# EAGLE design ramanPi_powerControlBoard (EAGLE 6.2)
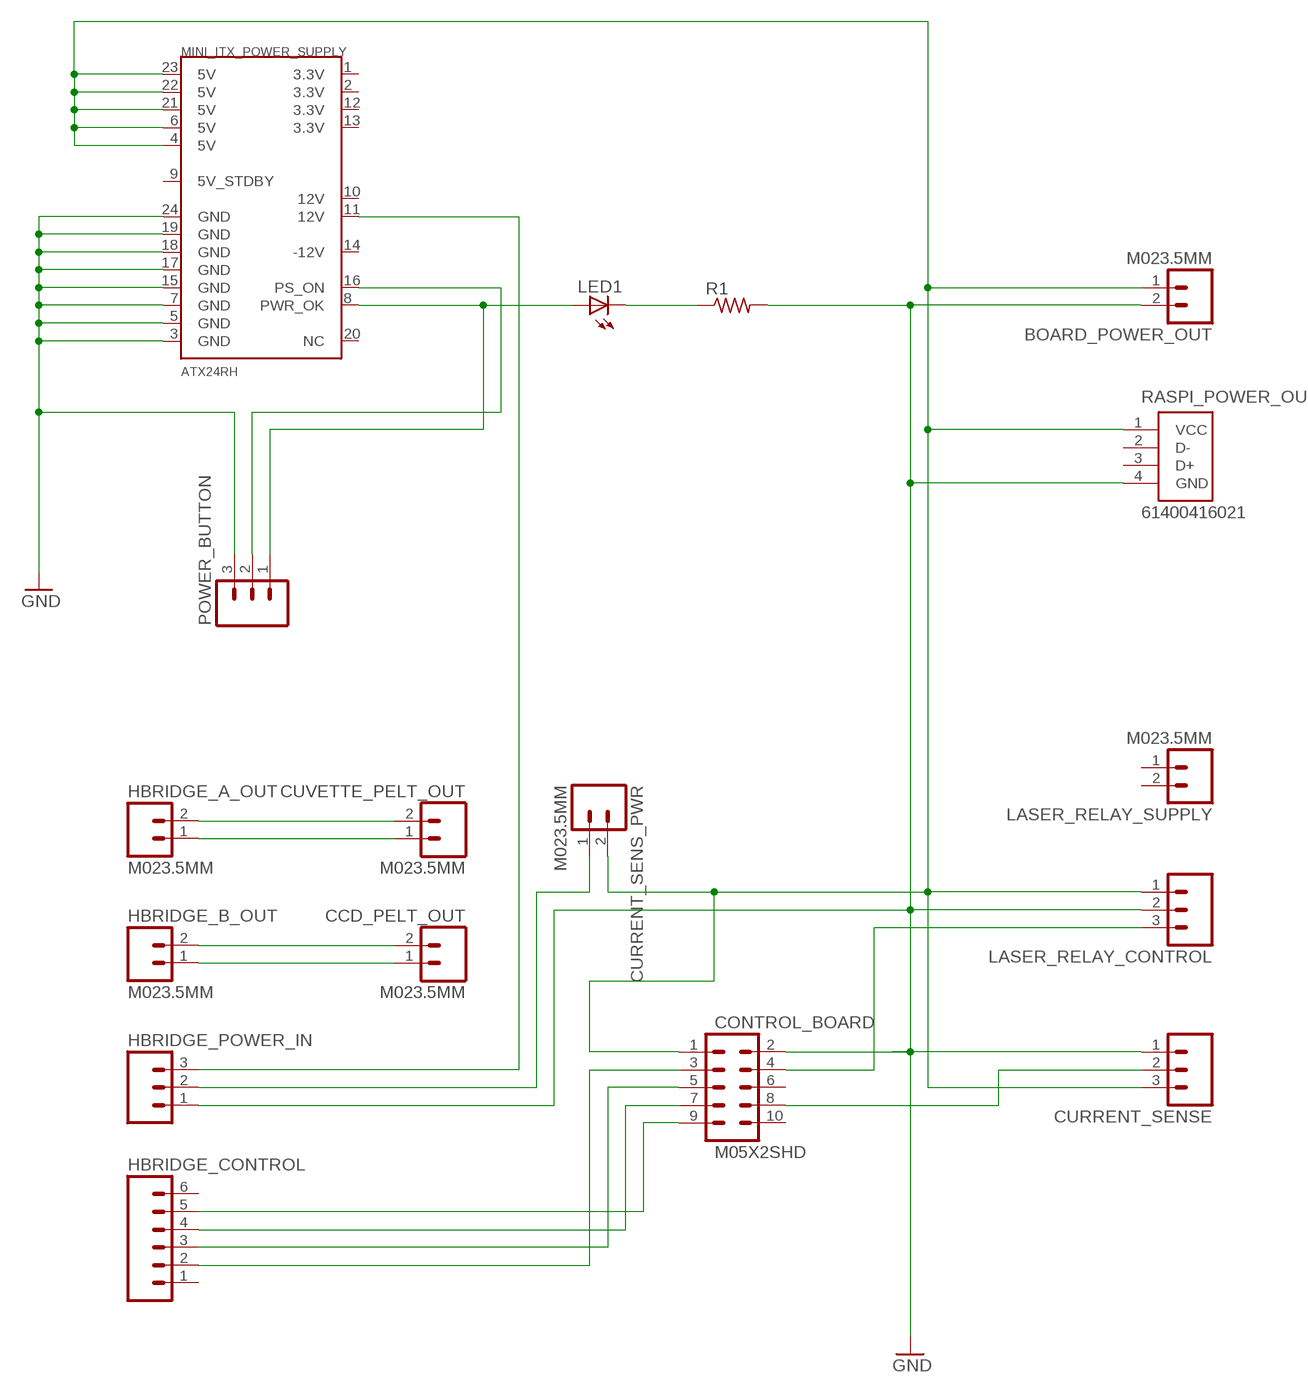
[diagram p0: schematic, sheet 1]

## Parts
BOARD_POWER_OUT  M023.5MM  [SCREWTERMINAL-3.5MM-2]
CCD_PELT_OUT  M023.5MM  [SCREWTERMINAL-3.5MM-2]
CONTROL_BOARD  M05X2SHD  [2X5-SHROUDED]
CURRENT_SENS_PWR  M023.5MM  [SCREWTERMINAL-3.5MM-2]
CURRENT_SENSE  M03PTH  [1X03]
CUVETTE_PELT_OUT  M023.5MM  [SCREWTERMINAL-3.5MM-2]
HBRIDGE_A_OUT  M023.5MM  [SCREWTERMINAL-3.5MM-2]
HBRIDGE_B_OUT  M023.5MM  [SCREWTERMINAL-3.5MM-2]
HBRIDGE_CONTROL  M06SIP  [1X06]
HBRIDGE_POWER_IN  M03SCREW  [SCREWTERMINAL-3.5MM-3]
LASER_RELAY_CONTROL  M03PTH  [1X03]
LASER_RELAY_SUPPLY  M023.5MM  [SCREWTERMINAL-3.5MM-2]
LED1  LED5MM  [LED5MM]
MINI_ITX_POWER_SUPPLY  ATX24RH  [ATX24_RIGHT_ANGLE]
POWER_BUTTON  M03JST-PTH-VERT  [JST-3-PTH-VERT]
R1  R-US_M1206  [M1206]
RASPI_POWER_OUT  61400416021  [61400416021]

## Nets
GND: BOARD_POWER_OUT.2 CONTROL_BOARD.2 CURRENT_SENSE.1 HBRIDGE_POWER_IN.1 LASER_RELAY_CONTROL.2 MINI_ITX_POWER_SUPPLY.3(GND) MINI_ITX_POWER_SUPPLY.5(GND) MINI_ITX_POWER_SUPPLY.7(GND) MINI_ITX_POWER_SUPPLY.15(GND) MINI_ITX_POWER_SUPPLY.17(GND) MINI_ITX_POWER_SUPPLY.18(GND) MINI_ITX_POWER_SUPPLY.19(GND) MINI_ITX_POWER_SUPPLY.24(GND) POWER_BUTTON.3 R1.2 RASPI_POWER_OUT.4(GND)
N$1: CONTROL_BOARD.4 LASER_RELAY_CONTROL.3
N$2: LED1.A MINI_ITX_POWER_SUPPLY.8(PWR_OK) POWER_BUTTON.1
N$3: CONTROL_BOARD.8 CURRENT_SENSE.2
N$5: MINI_ITX_POWER_SUPPLY.16(PS_ON) POWER_BUTTON.2
N$6: LED1.K(C) R1.1
N$7: CONTROL_BOARD.9 HBRIDGE_CONTROL.5
N$8: HBRIDGE_POWER_IN.3 MINI_ITX_POWER_SUPPLY.11(12V)
N$9: CUVETTE_PELT_OUT.1 HBRIDGE_A_OUT.1
N$10: CUVETTE_PELT_OUT.2 HBRIDGE_A_OUT.2
N$11: CCD_PELT_OUT.2 HBRIDGE_B_OUT.2
N$12: CCD_PELT_OUT.1 HBRIDGE_B_OUT.1
N$13: CONTROL_BOARD.7 HBRIDGE_CONTROL.4
N$14: CONTROL_BOARD.5 HBRIDGE_CONTROL.3
N$15: CONTROL_BOARD.3 HBRIDGE_CONTROL.2
N$16: CURRENT_SENS_PWR.1 HBRIDGE_POWER_IN.2
N$17: BOARD_POWER_OUT.1 CONTROL_BOARD.1 CURRENT_SENS_PWR.2 CURRENT_SENSE.3 LASER_RELAY_CONTROL.1 MINI_ITX_POWER_SUPPLY.4(5V) MINI_ITX_POWER_SUPPLY.6(5V) MINI_ITX_POWER_SUPPLY.21(5V) MINI_ITX_POWER_SUPPLY.22(5V) MINI_ITX_POWER_SUPPLY.23(5V) RASPI_POWER_OUT.1(VCC)
Unconnected: CONTROL_BOARD.6 CONTROL_BOARD.10 HBRIDGE_CONTROL.1 HBRIDGE_CONTROL.6 LASER_RELAY_SUPPLY.1 LASER_RELAY_SUPPLY.2 MINI_ITX_POWER_SUPPLY.1(3.3V) MINI_ITX_POWER_SUPPLY.2(3.3V) MINI_ITX_POWER_SUPPLY.9(5V_STDBY) MINI_ITX_POWER_SUPPLY.10(12V) MINI_ITX_POWER_SUPPLY.12(3.3V) MINI_ITX_POWER_SUPPLY.13(3.3V) MINI_ITX_POWER_SUPPLY.14(-12V) MINI_ITX_POWER_SUPPLY.20(NC) RASPI_POWER_OUT.2(D-) RASPI_POWER_OUT.3(D+)

## Library data of the parts
BOARD_POWER_OUT CCD_PELT_OUT CURRENT_SENS_PWR CUVETTE_PELT_OUT HBRIDGE_A_OUT HBRIDGE_B_OUT LASER_RELAY_SUPPLY = SparkFun-Connectors:M02: Standard 2-pin 0.1" header. Use with - straight break away headers ( PRT-00116) - right angle break away headers (PRT-00553) - swiss pins (PRT-00743) - machine pins (PRT-00117) - female headers (PRT-00115) Molex polarized connector foot print use with: PRT-08233 with associated crimp pins and housings. 2.54_SCREWTERM for use with PRT-10571. 3.5mm Screw Terminal footprints for PRT-08084 5mm Screw Terminal footprints for use with PRT-08433
CONTROL_BOARD = SparkFun-Connectors:M05X2: Header 5x2 Standard 10-pin dual row 0.1" header. Commonly used with AVR-ISP. Use with Spark Fun Electronics SKU: PRT-00778
CURRENT_SENSE HBRIDGE_POWER_IN LASER_RELAY_CONTROL POWER_BUTTON = SparkFun-Connectors:M03: Header 3 Standard 3-pin 0.1" header. Use with straight break away headers (SKU : PRT-00116), right angle break away headers (PRT-00553), swiss pins (PRT-00743), machine pins (PRT-00117), and female headers (PRT-00115). Molex polarized connector foot print use with SKU : PRT-08232 with associated crimp pins and housings.
HBRIDGE_CONTROL = SparkFun-Connectors:M06: Header 6 Standard 6-pin 0.1" header. Use with straight break away headers (SKU : PRT-00116), right angle break away headers (PRT-00553), swiss pins (PRT-00743), machine pins (PRT-00117), and female headers (PRT-00115). Molex polarized connector foot print use with SKU : PRT-08094 with associated crimp pins and housings. NOTES ON THE VARIANTS LOCK and LOCK_LONGPADS... This footprint was designed to help hold the alignment of a through-hole component (i.e. 6-pin header) while soldering it into place. You may notice that each hole has been shifted either up or down by 0.005 of an inch from it's more standard position (which is a perfectly straight line). This slight alteration caused the pins (the squares in the middle) to touch the edges of the holes. Because they are alternating, it causes a "brace" to hold the component in place. 0.005 has proven to be the perfect amount of "off-center" position when using our standard breakaway headers. Although looks a little odd when you look at the bare footprint, once you have a header in there, the alteration is very hard to notice. Also,if you push a header all the way into place, it is covered up entirely on the bottom side. This idea of altering the position of holes to aid alignment will be further integrated into the Sparkfun Library for other footprints. It can help hold any component with 3 or more connection pins.
LED1 = adafruit:LED: LED OSRAM: - CHIPLED LG R971, LG N971, LY N971, LG Q971, LY Q971, LO R971, LY R971 LH N974, LH R974 LS Q976, LO Q976, LY Q976 LO Q996 - Hyper CHIPLED LW Q18S LB Q993, LB Q99A, LB R99A - SideLED LS A670, LO A670, LY A670, LG A670, LP A670 LB A673, LV A673, LT A673, LW A673 LH A674 LY A675 LS A676, LA A676, LO A676, LY A676, LW A676 LS A679, LY A679, LG A679 - Hyper Micro SIDELED® LS Y876, LA Y876, LO Y876, LY Y876 LT Y87S - SmartLED LW L88C, LW L88S LB L89C, LB L89S, LG L890 LS L89K, LO L89K, LY L89K LS L896, LA L896, LO L896, LY L896 - TOPLED LS T670, LO T670, LY T670, LG T670, LP T670 LSG T670, LSP T670, LSY T670, LOP T670, LYG T670 LG T671, LOG T671, LSG T671 LB T673, LV T673, LT T673, LW T673 LH T674 LS T676, LA T676, LO T676, LY T676, LB T676, LH T676, LSB T676, LW T676 LB T67C, LV T67C, LT T67C, LS T67K, LO T67K, LY T67K, LW E67C LS E67B, LA E67B, LO E67B, LY E67B, LB E67C, LV E67C, LT E67C LW T67C LS T679, LY T679, LG T679 LS T770, LO T770, LY T770, LG T770, LP T770 LB T773, LV T773, LT T773, LW T773 LH T774 LS E675, LA E675, LY E675, LS T675 LS T776, LA T776, LO T776, LY T776, LB T776 LHGB T686 LT T68C, LB T68C - Hyper Mini TOPLED® LB M676 - Mini TOPLED Santana® LG M470 LS M47K, LO M47K, LY M47K Source: http://www.osram.convergy.de/
MINI_ITX_POWER_SUPPLY = SparkFun-Connectors:ATX24: ATX24 Pin Power Supply Connector This is a good connector for connecting a computer power supply to a PCB. It's massive, but provides many amps of power at 5V and 12V. SKU: PRT-09498
R1 = adafruit:R-US_: RESISTOR, American symbol
RASPI_POWER_OUT = Wuerth_Elektronik_eiCan_Communication_Connectors:61400416021: WR-COM Horizontal USB Type A

## Board
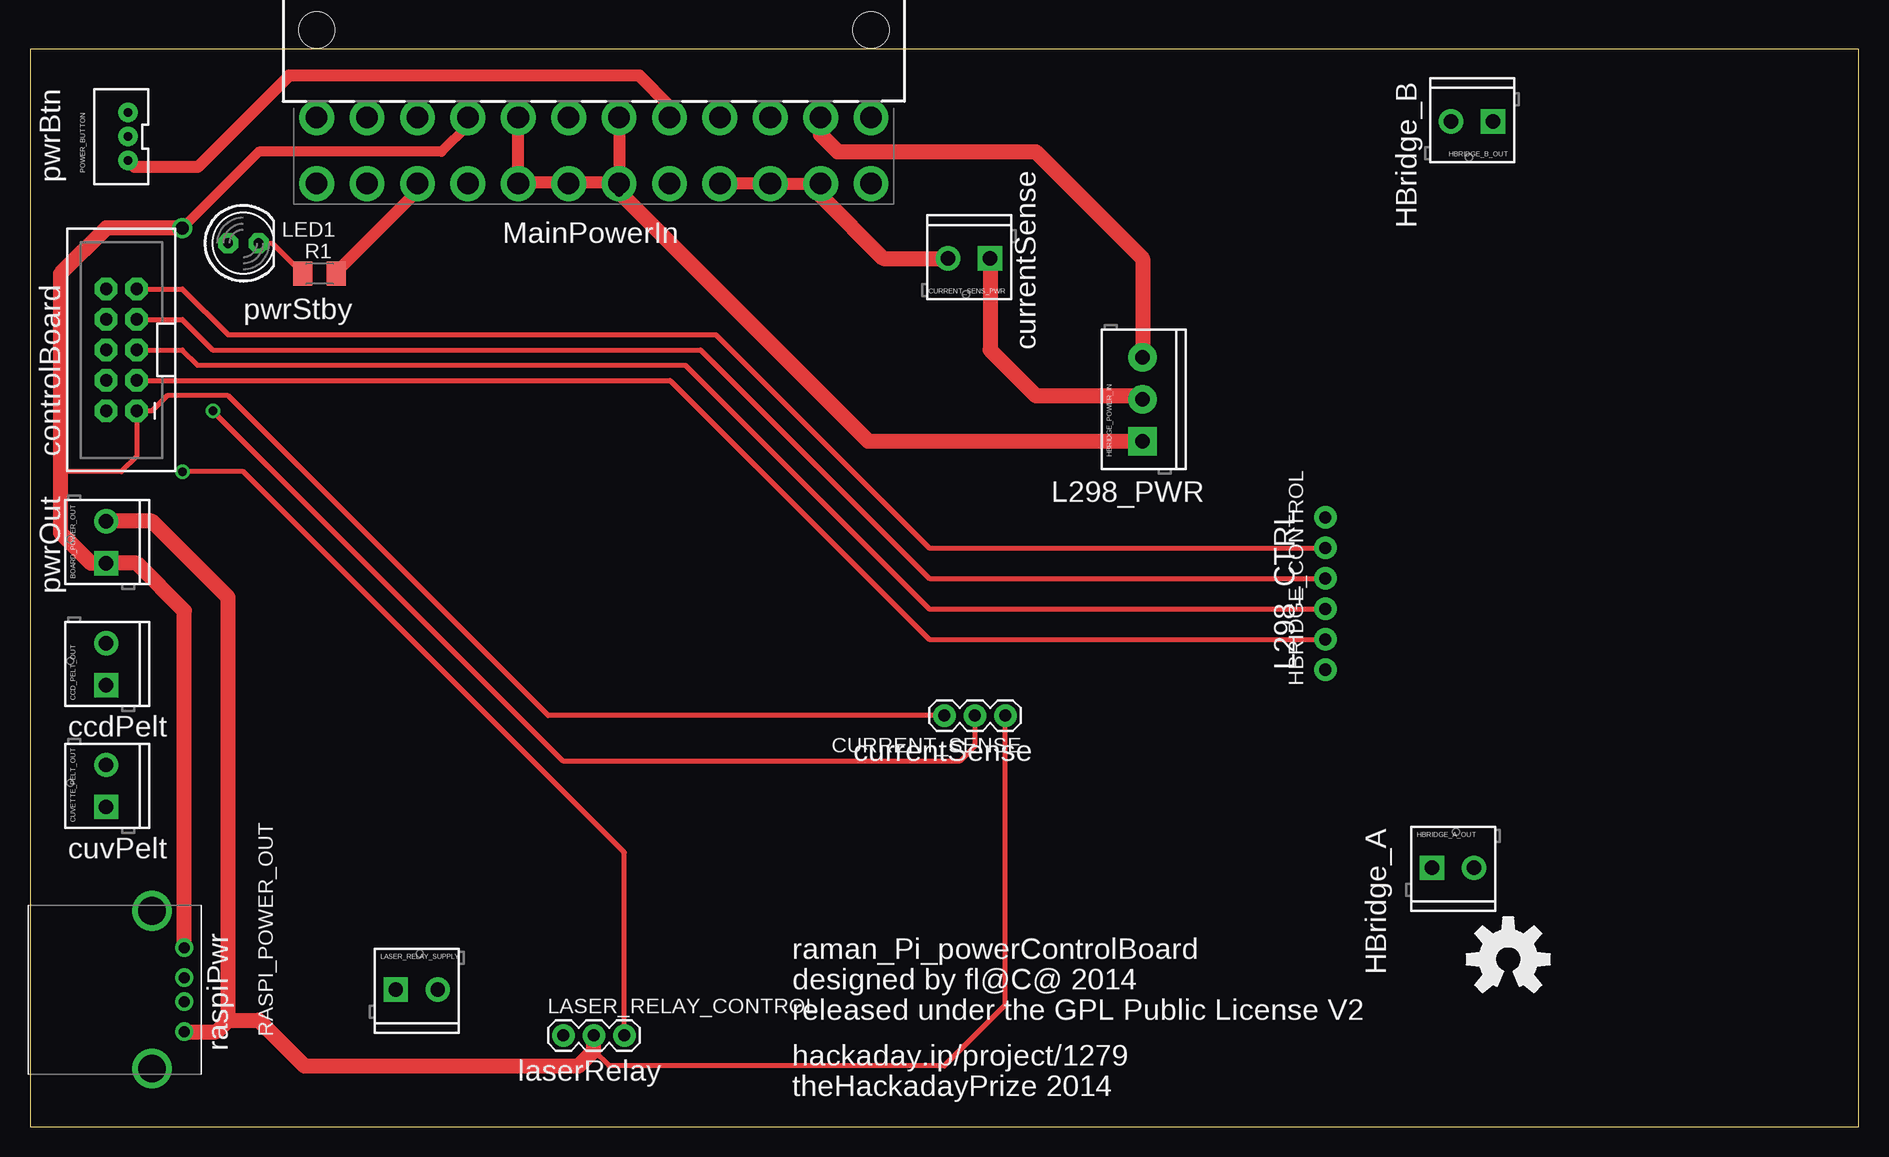
[diagram p1: board, top side]
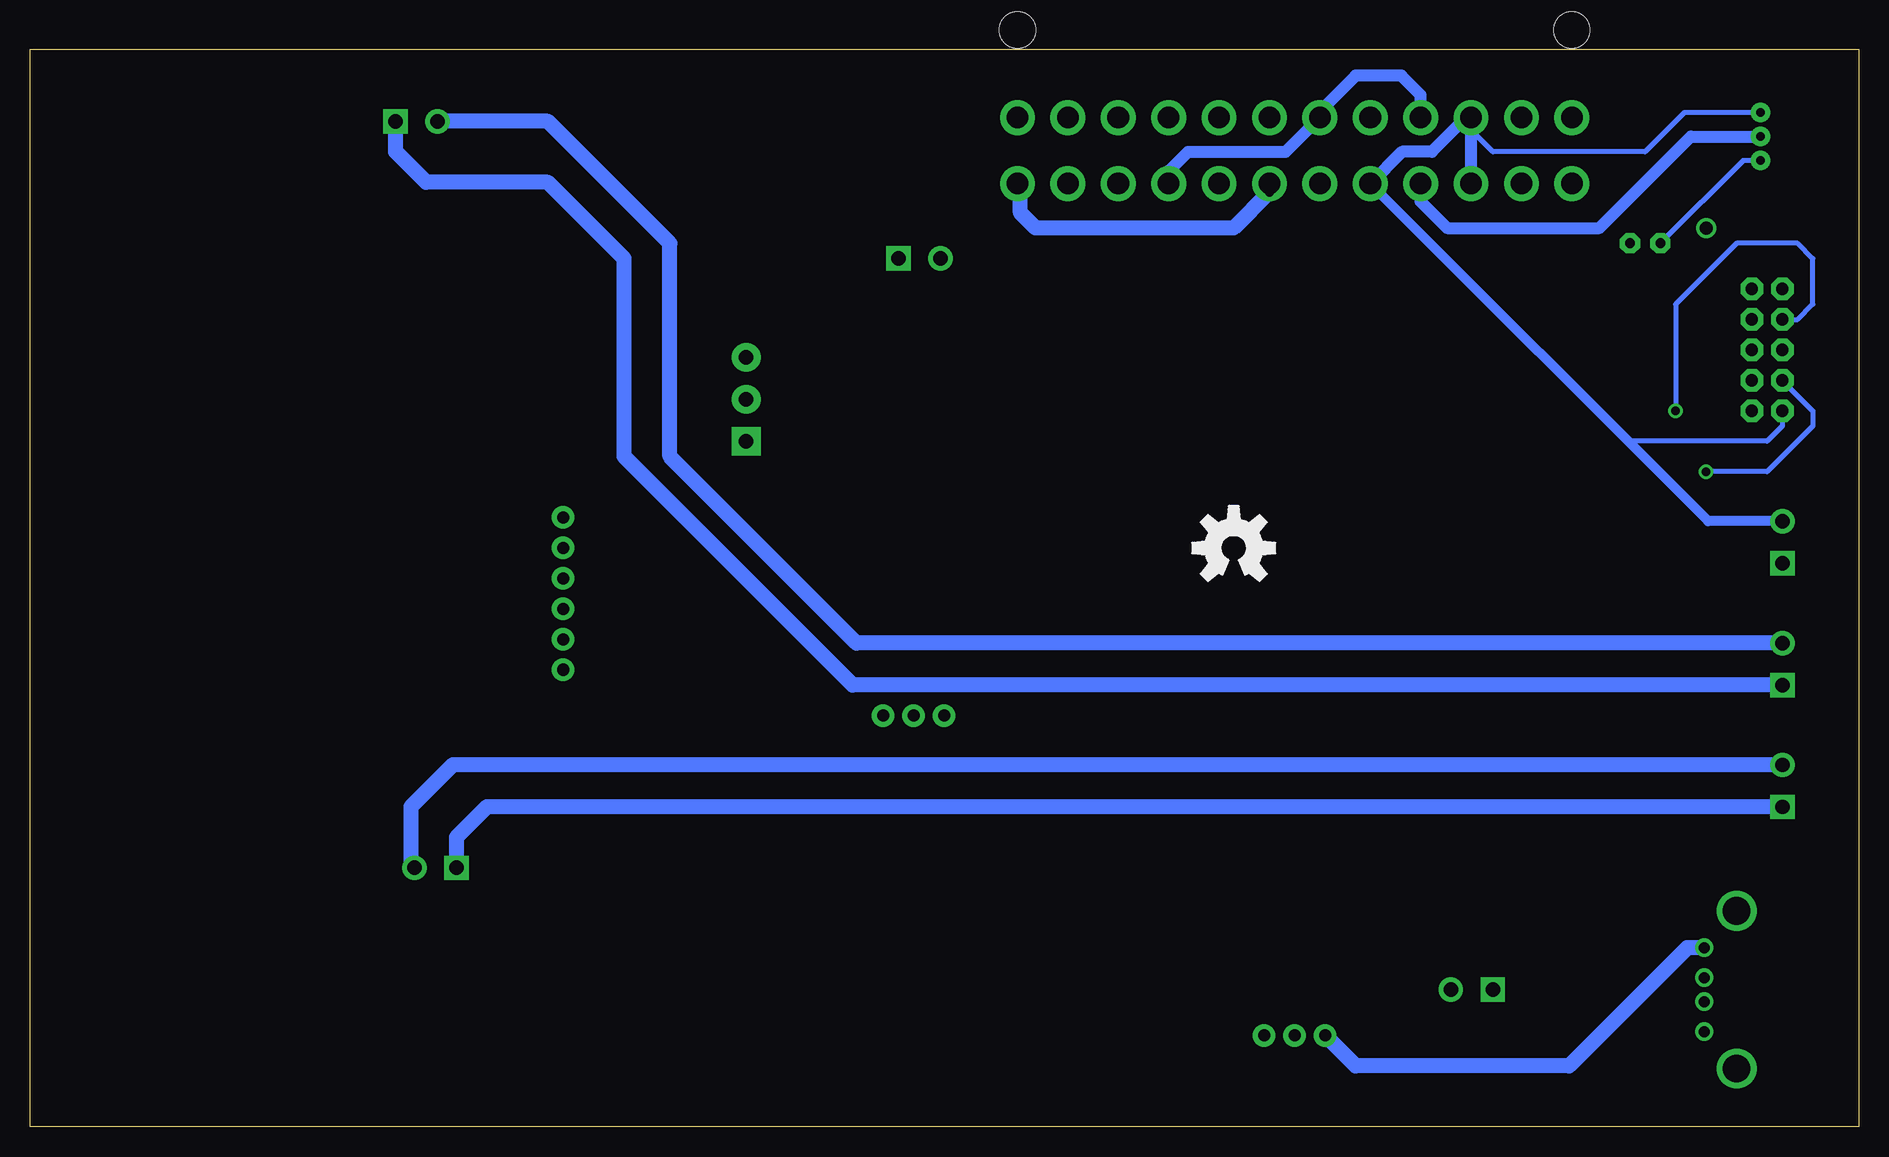
[diagram p2: board, bottom side, seen from below]

Size 152.38 x 89.84 mm. Coordinates in mm from the lower left corner, seen from the top.
Outline: 0,0 152.38,0 152.38,89.84 0,89.84 0,0
Copper layers (1*16): Top 0.035mm / dielectric 1.5mm / Bottom 0.035mm
Design rules: minimum track width 8mil, minimum drill 20mil, track to track 8mil, track to pad 8mil, pad to pad 8mil, via to via 8mil, smd to smd 8mil, copper to edge 10mil, drill to drill 8mil, minimum pad ring 12mil, minimum via ring 10mil, stop-mask expansion 4mil, vias tented up to drill 25mil, thermal gap 10mil

### Footprints (pad centres in the part's own frame; a part is rotated, then mirrored left to right if it is on the bottom)
SCREWTERMINAL-3.5MM-2 = drill 1.2 pad 2.032 square: 1 0,0 | drill 1.2 pad 2.032: 2 3.5,0
2X5-SHROUDED = drill 1.016 pad 1.88 octagon: 1 -1.27,5.08; 2 1.27,5.08; 3 -1.27,2.54; 4 1.27,2.54; 5 -1.27,0; 6 1.27,0; 7 -1.27,-2.54; 8 1.27,-2.54; 9 -1.27,-5.08; 10 1.27,-5.08
1X03 = drill 1.016 pad 1.88: 1 0,0; 2 2.54,0; 3 5.08,0
1X06 = drill 1.016 pad 1.88: 1 0,0; 2 2.54,0; 3 5.08,0; 4 7.62,0; 5 10.16,0; 6 12.7,0
SCREWTERMINAL-3.5MM-3 = drill 1.2 pad 2.413 square: 1 0,0 | drill 1.2 pad 2.413: 2 3.5,0; 3 7,0
LED5MM = drill 0.813 pad 1.676 octagon: A -1.27,0; K 1.27,0
ATX24_RIGHT_ANGLE = drill 1.8 pad 2.9: 1 23.1,4.76; 2 18.9,4.76; 3 14.7,4.76; 4 10.5,4.76; 5 6.3,4.76; 6 2.1,4.76; 7 -2.1,4.76; 8 -6.3,4.76; 9 -10.5,4.76; 10 -14.7,4.76; 11 -18.9,4.76; 12 -23.1,4.76; 13 23.1,10.26; 14 18.9,10.26; 15 14.7,10.26; 16 10.5,10.26; 17 6.3,10.26; 18 2.1,10.26; 19 -2.1,10.26; 20 -6.3,10.26; 21 -10.5,10.26; 22 -14.7,10.26; 23 -18.9,10.26; 24 -23.1,10.26 | hole 3: -23.1,-2.54; 23.1,-2.54
JST-3-PTH-VERT = drill 0.7 pad 1.626: 1 -2,-0.55; 2 0,-0.55; 3 2,-0.55
M1206 = smd 1.6 x 2: 1 -1.4,0; 2 1.4,0
61400416021 = drill 0.92: 1 -3.5,2.7; 2 -1,2.7; 3 1,2.7; 4 3.5,2.7 | drill 2.3: 5 -6.57,0; 6 6.57,0

### Placement (x,y rotation side)
BOARD_POWER_OUT  6.35,46.99 90 top
CCD_PELT_OUT  6.35,36.83 90 top
CONTROL_BOARD  7.62,64.77 180 top
CURRENT_SENS_PWR  80.01,72.39 180 top
CURRENT_SENSE  81.28,34.29 180 top
CUVETTE_PELT_OUT  6.35,26.67 90 top
HBRIDGE_A_OUT  116.84,21.59 0 top
HBRIDGE_B_OUT  121.92,83.82 180 top
HBRIDGE_CONTROL  107.95,38.1 90 top
HBRIDGE_POWER_IN  92.71,57.15 90 top
LASER_RELAY_CONTROL  44.45,7.62 0 top
LASER_RELAY_SUPPLY  30.48,11.43 0 top
LED1  17.78,73.66 0 top
MINI_ITX_POWER_SUPPLY  46.99,88.9 180 top
POWER_BUTTON  7.62,82.55 90 top
R1  24.13,71.12 0 top
RASPI_POWER_OUT  10.16,11.43 270 top
U$1  [OSHW-LOGO-L]  123.19,13.97 0 top
U$2  [OSHW-LOGO-L]  52.07,48.26 0 bottom

### Tracks (layer width: path | path; a pad name or v marks a point on that pad's centre or on a via)
GND  (via drill 0.7)
  Top 0.406: 46.99,6.35 48.26,5.08 76.2,5.08 81.28,10.16 CURRENT_SENSE.1
  Top 1.016: MINI_ITX_POWER_SUPPLY.5 MINI_ITX_POWER_SUPPLY.17 41.81,78.64 41.91,78.74 44.79,78.74 MINI_ITX_POWER_SUPPLY.18 45.62,78.64 45.72,78.74 48.99,78.74 MINI_ITX_POWER_SUPPLY.19 MINI_ITX_POWER_SUPPLY.7 | MINI_ITX_POWER_SUPPLY.15 32.29,78.01 25.4,71.12 R1.2
  Top 1.27: RASPI_POWER_OUT.4 15.55,7.93 16.51,8.89 | 16.51,8.89 16.51,44.14 10.16,50.49 BOARD_POWER_OUT.2 | 16.51,8.89 19.05,8.89 22.86,5.08 45.72,5.08 46.99,6.35 LASER_RELAY_CONTROL.2 | MINI_ITX_POWER_SUPPLY.19 v49.09,77.91 69.85,57.15 HBRIDGE_POWER_IN.1
  Bottom 0.406: CONTROL_BOARD.2 6.35,58.42 7.62,57.15 19.2,57.15 MINI_ITX_POWER_SUPPLY.17 | POWER_BUTTON.3 14.51,84.55 17.78,81.28 30.48,81.28 33.02,83.82
  Bottom 0.813: BOARD_POWER_OUT.2 12.54,50.49 MINI_ITX_POWER_SUPPLY.17
  Bottom 1.016: MINI_ITX_POWER_SUPPLY.3 32.7,84.14 33.02,83.82 | 33.02,83.82 35.56,81.28 38.05,81.28 MINI_ITX_POWER_SUPPLY.17 | MINI_ITX_POWER_SUPPLY.15 32.29,83.09 33.02,83.82
  Bottom 1.27: v49.09,77.91 52.07,74.93 68.58,74.93 69.85,76.2 69.85,78.4 MINI_ITX_POWER_SUPPLY.24
N$1  (via drill 0.7)
  Top 0.406: LASER_RELAY_CONTROL.3 49.53,22.86 17.78,54.61 v12.7,54.61
  Bottom 0.406: CONTROL_BOARD.4 3.81,59.69 3.81,58.42 7.62,54.61 v12.7,54.61
N$2
  Top 1.016: MINI_ITX_POWER_SUPPLY.8 53.29,85.14 50.8,87.63 21.59,87.63 13.97,80.01 8.71,80.01 POWER_BUTTON.1
  Bottom 0.406: POWER_BUTTON.1 9.62,80.55 LED1.A
N$3  (via drill 0.7)
  Top 0.406: v15.24,59.69 44.45,30.48 77.47,30.48 78.74,31.75 CURRENT_SENSE.2
  Bottom 0.406: CONTROL_BOARD.8 5.08,67.31 3.81,68.58 3.81,72.39 5.08,73.66 10.16,73.66 15.24,68.58 v15.24,59.69
N$5
  Bottom 1.016: MINI_ITX_POWER_SUPPLY.16 36.49,77.13 34.29,74.93 21.59,74.93 13.97,82.55 POWER_BUTTON.2
N$6
  Top 0.406: LED1.K 20.19,73.66 R1.1
N$7
  Top 0.406: HBRIDGE_CONTROL.5 74.93,48.26 57.15,66.04 16.51,66.04 12.7,69.85 CONTROL_BOARD.9
N$8
  Top 1.27: MINI_ITX_POWER_SUPPLY.11 65.89,82.7 67.31,81.28 83.82,81.28 92.71,72.39 HBRIDGE_POWER_IN.3
N$9
  Bottom 1.27: CUVETTE_PELT_OUT.1 114.3,26.67 116.84,24.13 HBRIDGE_A_OUT.1
N$10
  Bottom 1.27: CUVETTE_PELT_OUT.2 117.15,30.17 120.65,26.67 120.65,21.9 HBRIDGE_A_OUT.2
N$11
  Bottom 1.27: CCD_PELT_OUT.2 83.51,40.33 99.06,55.88 99.06,73.66 109.22,83.82 HBRIDGE_B_OUT.2
N$12
  Bottom 1.27: CCD_PELT_OUT.1 83.82,36.83 102.87,55.88 102.87,72.39 109.22,78.74 119.38,78.74 121.92,81.28 HBRIDGE_B_OUT.1
N$13
  Top 0.406: CONTROL_BOARD.7 12.7,67.31 15.24,64.77 55.88,64.77 74.93,45.72 HBRIDGE_CONTROL.4
N$14
  Top 0.406: CONTROL_BOARD.5 12.7,64.77 13.97,63.5 54.61,63.5 74.93,43.18 HBRIDGE_CONTROL.3
N$15
  Top 0.406: CONTROL_BOARD.3 53.34,62.23 74.93,40.64 HBRIDGE_CONTROL.2
N$16
  Top 1.27: CURRENT_SENS_PWR.1 80.01,64.77 83.82,60.96 92.4,60.96 HBRIDGE_POWER_IN.2
N$17  (via drill 1.1)
  Top 0.406: 2.54,54.61 7.62,54.61 8.89,55.88 CONTROL_BOARD.1 10.16,59.69 11.43,60.96 16.51,60.96 43.18,34.29 CURRENT_SENSE.3
  Top 0.813: MINI_ITX_POWER_SUPPLY.4 36.49,83.48 34.29,81.28 19.05,81.28 v12.7,74.93 | MINI_ITX_POWER_SUPPLY.23 65.89,77.62
  Top 1.016: MINI_ITX_POWER_SUPPLY.21 MINI_ITX_POWER_SUPPLY.22 MINI_ITX_POWER_SUPPLY.23
  Top 1.27: 65.89,77.62 71.12,72.39 CURRENT_SENS_PWR.2 | RASPI_POWER_OUT.1 12.86,43.02 8.89,46.99 BOARD_POWER_OUT.1 5.08,46.99 2.54,49.53 2.54,54.61 2.54,71.12 6.35,74.93 v12.7,74.93
  Bottom 1.016: MINI_ITX_POWER_SUPPLY.21 57.49,79.67 55.88,81.28 47.75,81.28 MINI_ITX_POWER_SUPPLY.6 44.45,84.58 44.45,85.09 41.91,87.63 38.1,87.63 36.49,86.02 MINI_ITX_POWER_SUPPLY.4
  Bottom 1.27: RASPI_POWER_OUT.1 14.28,14.93 24.13,5.08 41.91,5.08 LASER_RELAY_CONTROL.1

### Text on the board
tPlace: pwrBtn | HBridge_B | MainPowerIn | pwrStby | currentSense | controlBoard | L298_PWR | pwrOut | L298_CTRL | ccdPelt | currentSense | cuvPelt | raman_Pi_powerControlBoard | HBridge_A | designed by fl@C@ 2014 | released under the GPL Public License V2 | raspiPwr | hackaday.ip/project/1279 | laserRelay | theHackadayPrize 2014